# EAGLE schematic crystal-oscillators (EAGLE 7.7.0)
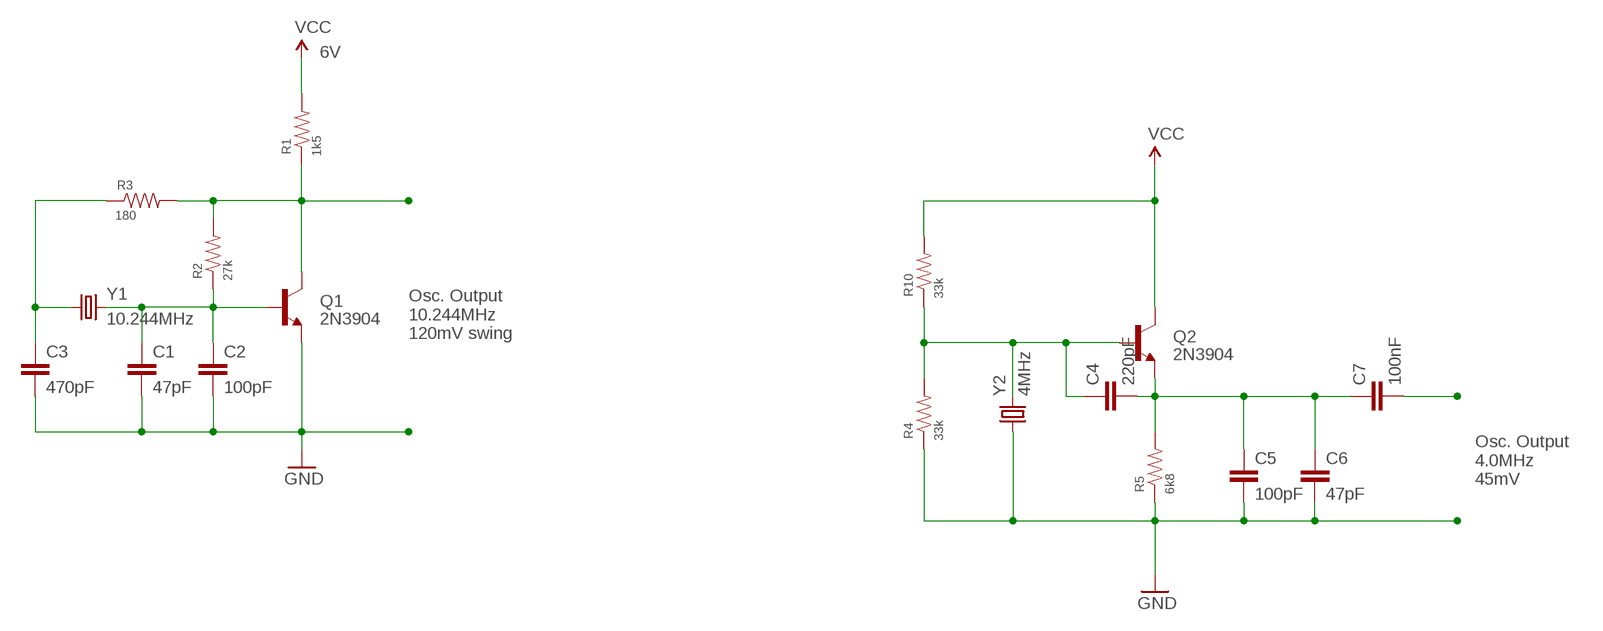
[diagram p0: schematic, sheet 1]

## Parts
C1  47pF  CAPPTH  [CAP-PTH-SMALL]
C2  100pF  CAPPTH  [CAP-PTH-SMALL]
C3  470pF  CAPPTH  [CAP-PTH-SMALL]
C4  220pF  CAPPTH  [CAP-PTH-SMALL]
C5  100pF  CAPPTH  [CAP-PTH-SMALL]
C6  47pF  CAPPTH  [CAP-PTH-SMALL]
C7  100nF  CAPPTH  [CAP-PTH-SMALL]
Q1  2N3904  TRANSISTOR_NPNP2N2222A  [TO-92]
Q2  2N3904  TRANSISTOR_NPNP2N2222A  [TO-92]
R1  1k5  RESISTOR-PTH  [VERT-PTH]
R2  27k  RESISTOR-PTH  [VERT-PTH]
R3  180  RESISTOR-PTH  [VERT-PTH]
R4  33k  RESISTOR-PTH  [VERT-PTH]
R5  6k8  RESISTOR-PTH  [VERT-PTH]
R10  33k  RESISTOR-PTH  [VERT-PTH]
Y1  10.244MHz  CRYSTALHC49US  [HC49US]
Y2  4MHz  CRYSTALHC49US  [HC49US]

## Nets
GND: C1.2 C2.2 C3.2 C5.2 C6.2 Q1.3(E) R4.1(G$1) R5.1(G$1) Y2.1
N$1: C1.1 C2.1 Q1.2(B) R2.1(G$1) Y1.2
N$2: Q1.1(C) R1.1(G$1) R2.2(G$2) R3.2(G$2)
N$3: C4.2 C5.1 C6.1 C7.1 Q2.3(E) R5.2(G$2)
N$4: C4.1 Q2.2(B) R4.2(G$2) R10.1(G$1) Y2.2
N$5: C7.2
N$6: C3.1 R3.1(G$1) Y1.1
VCC: Q2.1(C) R1.2(G$2) R10.2(G$2)

## Notes on the sheet
- 6V
- Osc. Output
  10.244MHz
  120mV swing
- Osc. Output
  4.0MHz
  45mV

## Library data of the parts
C1-C7 = SparkFun-Capacitors:CAP: Capacitor Standard 0603 ceramic capacitor, and 0.1" leaded capacitor.
Q1 Q2 = SparkFun-DiscreteSemi:TRANSISTOR_NPN: Generic NPN BJT MMBT2222A - TRANS-08049 (SOT-23, 1A 40V) MPSA42 - TRANS-09116 (SOT-23, 500mA 300V) MMBT5088LT1G - TRANS-11160 (SOT-23, 50 mA 30V) BC547 - COM-08928 <http://www.sparkfun.com/products/8928> (TO-92 45V 100mA) (1.Collector 2.Base 3.Emitter) 2N3904 - COM-00521 <http://www.sparkfun.com/products/521> (TO-92 40V 200mA) (1.Emitter 2.Base 3.Collector) P2N2222A - COM-12852 <http://www.sparkfun.com/products/12852> (TO-92 40V 600mA) (1.Collector 2.Base 3.Emitter); PROD_ID: TRANS-09536
R1-R5 R10 = Synapseware:RESISTOR-PTH
Y1 Y2 = SparkFun-FreqCtrl:CRYSTAL: Various standard crystals. Proven footprints.